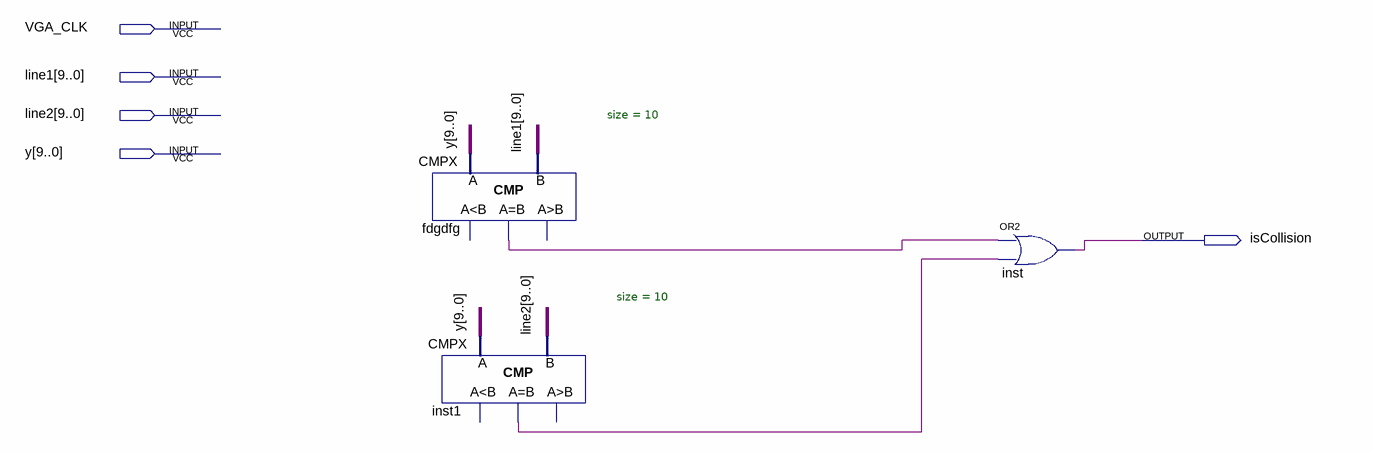
[diagram p0: schematic sheet]
// Quartus schematic horizontalLine.bdf as structural Verilog: 3 symbols, 5 pins
module horizontalLine (
  input  VGA_CLK,
  input  [9:0] line1,
  input  [9:0] line2,
  input  [9:0] y,
  output isCollision
);

  wire fdgdfg_eq, inst1_eq;

  CMPX #(.size(10)) fdgdfg (.A(y), .B(line1), .eq(fdgdfg_eq));  // open: ls, gr
  CMPX #(.size(10)) inst1 (.A(y), .B(line2), .eq(inst1_eq));  // open: ls, gr
  or inst (isCollision, fdgdfg_eq, inst1_eq);
endmodule
